# EAGLE design Raspberry_Zero_PLC_v1.0 (EAGLE 9.2.2)
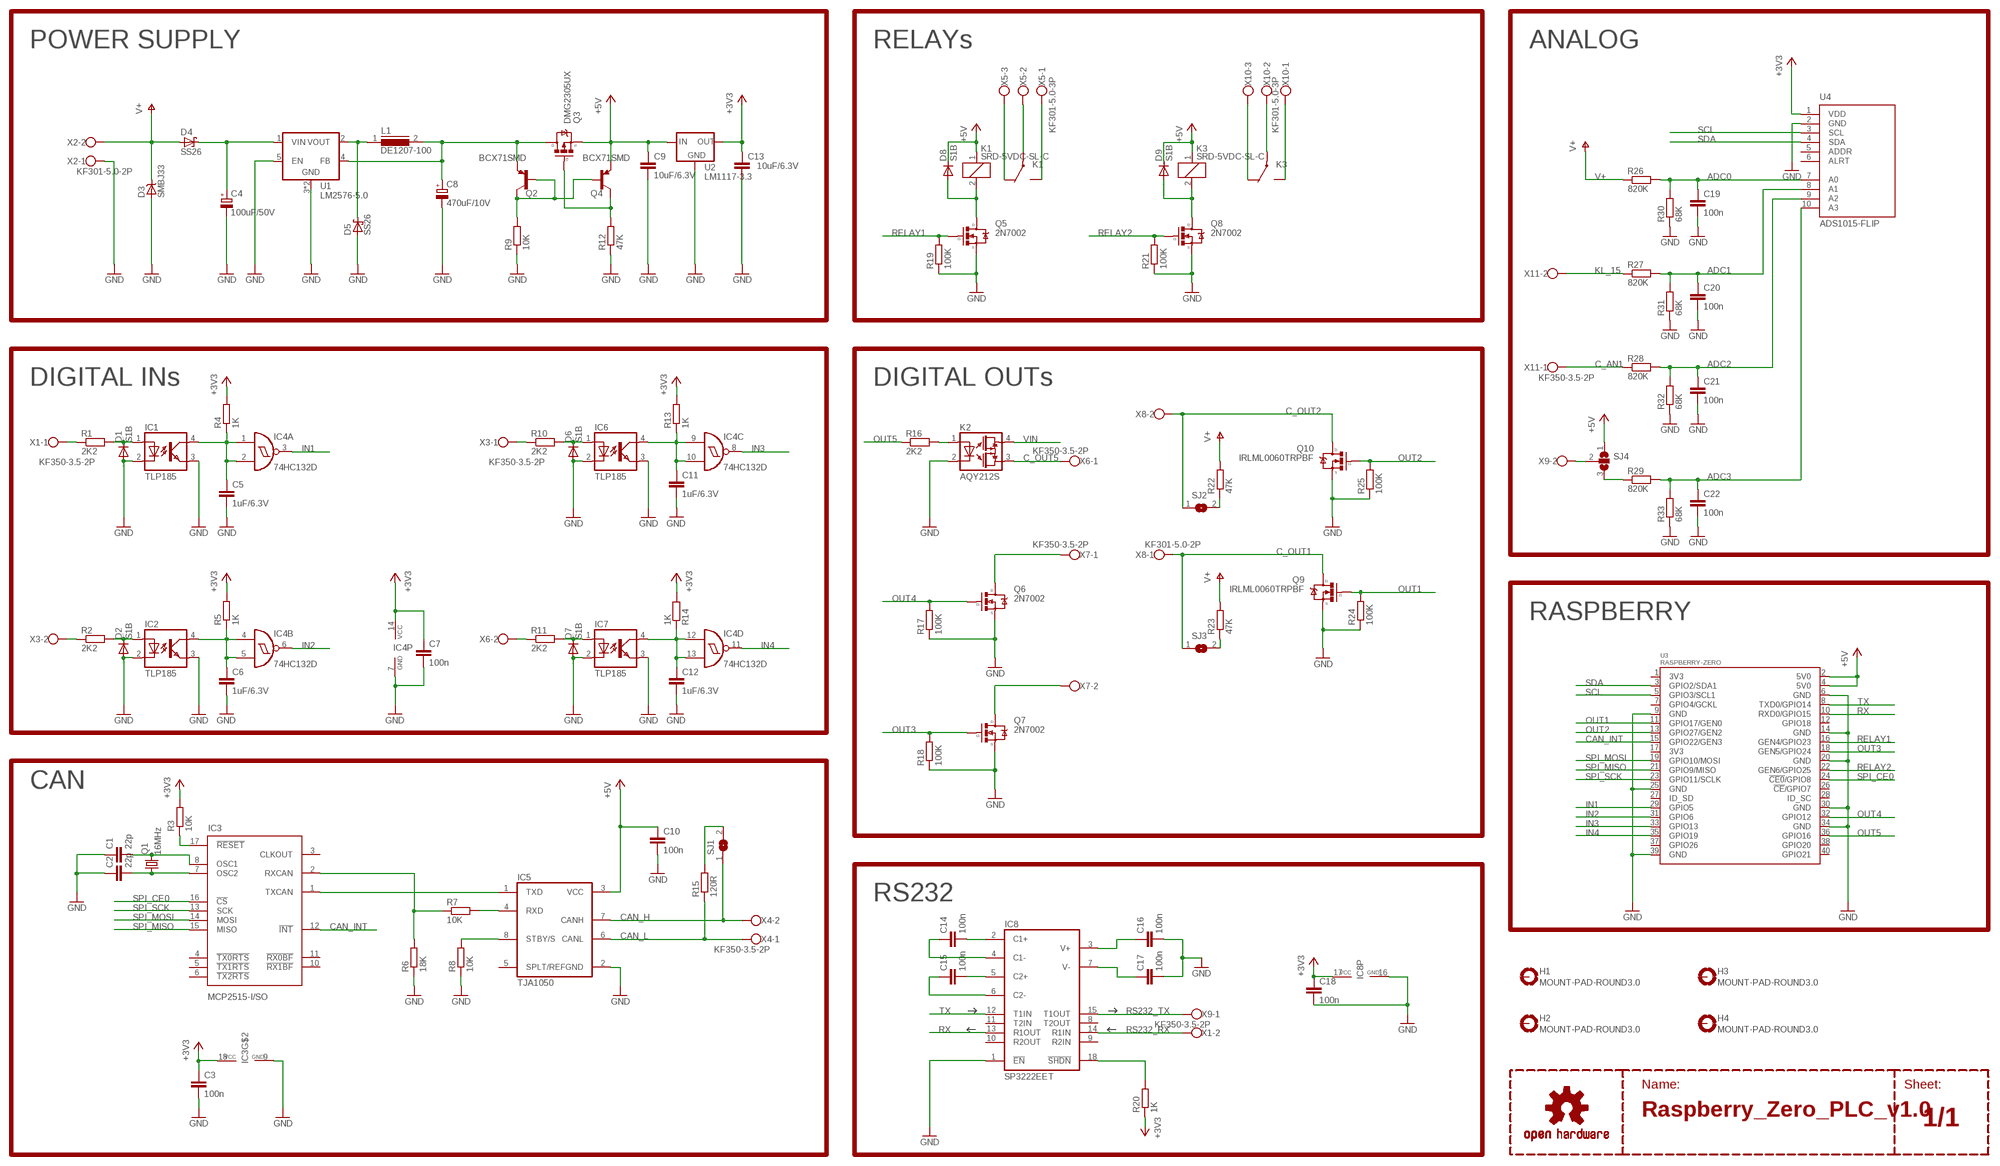
[diagram p0: schematic, sheet 1]

## Parts
C1  22p  C-EUC0805  [C0805]
C2  22p  C-EUC0805  [C0805]
C3  100n  C-EUC0805  [C0805]
C4  100uF/50V  CPOL-EUE  [PANASONIC_E]
C5  1uF/6.3V  C-EUC0805  [C0805]
C6  1uF/6.3V  C-EUC0805  [C0805]
C7  100n  C-EUC0805  [C0805]
C8  470uF/10V  CPOL-EUE  [PANASONIC_E]
C9  10uF/6.3V  C-EUC0805  [C0805]
C10  100n  C-EUC0805  [C0805]
C11  1uF/6.3V  C-EUC0805  [C0805]
C12  1uF/6.3V  C-EUC0805  [C0805]
C13  10uF/6.3V  C-EUC0805  [C0805]
C14  100n  C-EUC0805  [C0805]
C15  100n  C-EUC0805  [C0805]
C16  100n  C-EUC0805  [C0805]
C17  100n  C-EUC0805  [C0805]
C18  100n  C-EUC0805  [C0805]
C19  100n  C-EUC0805  [C0805]
C20  100n  C-EUC0805  [C0805]
C21  100n  C-EUC0805  [C0805]
C22  100n  C-EUC0805  [C0805]
D1  S1B  [DO214AC]
D2  S1B  [DO214AC]
D3  SMBJ33  [DO214AA]
D4  SS26  [DO214AA]
D5  SS26  [DO214AA]
D6  S1B  [DO214AC]
D7  S1B  [DO214AC]
D8  S1B  [DO214AC]
D9  S1B  [DO214AC]
H1  MOUNT-PAD-ROUND3.0  [3,0-PAD]
H2  MOUNT-PAD-ROUND3.0  [3,0-PAD]
H3  MOUNT-PAD-ROUND3.0  [3,0-PAD]
H4  MOUNT-PAD-ROUND3.0  [3,0-PAD]
IC1  TLP185  [SOP04]
IC2  TLP185  [SOP04]
IC3  MCP2515-I/SO  [SO-18L]
IC4  74HC132D  [SO14]
IC5  TJA1050  [SO08]
IC6  TLP185  [SOP04]
IC7  TLP185  [SOP04]
IC8  SP3222EET  [SO-18L]
K1  SRD-5VDC-SL-C  [SRD]
K2  AQY212S  CPC1008N  [SOP04]
K3  SRD-5VDC-SL-C  [SRD]
L1  DE1207-100  DR125  [DR125]
LOGO1  OSHW-LOGOM-COPPER  [OSHW-LOGO-M_COPPER]
Q1  16MHz  CRYSTALHC49U-V  [HC49U-V]
Q2  BCX71SMD  [SOT23]
Q3  DMG2305UX  [SOT23]
Q4  BCX71SMD  [SOT23]
Q5  2N7002  [SOT23]
Q6  2N7002  [SOT23]
Q7  2N7002  [SOT23]
Q8  2N7002  [SOT23]
Q9  IRLML0060TRPBF  [SOT23]
Q10  IRLML0060TRPBF  [SOT23]
R1  2K2  R-EU_R0805  [R0805]
R2  2K2  R-EU_R0805  [R0805]
R3  10K  R-EU_R0805  [R0805]
R4  1K  R-EU_R0805  [R0805]
R5  1K  R-EU_R0805  [R0805]
R6  18K  R-EU_R0805  [R0805]
R7  10K  R-EU_R0805  [R0805]
R8  10K  R-EU_R0805  [R0805]
R9  10K  R-EU_R0805  [R0805]
R10  2K2  R-EU_R0805  [R0805]
R11  2K2  R-EU_R0805  [R0805]
R12  47K  R-EU_R0805  [R0805]
R13  1K  R-EU_R0805  [R0805]
R14  1K  R-EU_R0805  [R0805]
R15  120R  R-EU_R1206  [R1206]
R16  2K2  R-EU_R0805  [R0805]
R17  100K  R-EU_R0805  [R0805]
R18  100K  R-EU_R0805  [R0805]
R19  100K  R-EU_R0805  [R0805]
R20  1K  R-EU_R0805  [R0805]
R21  100K  R-EU_R0805  [R0805]
R22  47K  R-EU_R0805  [R0805]
R23  47K  R-EU_R0805  [R0805]
R24  100K  R-EU_R0805  [R0805]
R25  100K  R-EU_R0805  [R0805]
R26  820K  R-EU_R0805  [R0805]
R27  820K  R-EU_R0805  [R0805]
R28  820K  R-EU_R0805  [R0805]
R29  820K  R-EU_R0805  [R0805]
R30  68K  R-EU_R0805  [R0805]
R31  68K  R-EU_R0805  [R0805]
R32  68K  R-EU_R0805  [R0805]
R33  68K  R-EU_R0805  [R0805]
SJ1  SJ  [SJ]
SJ2  SJ  [SJ]
SJ3  SJ  [SJ]
SJ4  SJ2W  [SJ_2]
U1  LM2576-5.0  [TO-263-5]
U2  LM1117-3.3  [SOT223]
U3  RASPBERRY-ZERO  [RASPBERRYPI_ZERO]
U4  ADS1015-FLIP  [ADS1115-_FLIP]
X1  KF350-3.5-2P  [KF350-3.50-2P]
X2  KF301-5.0-2P  [KF301-5.0-2P]
X3  KF350-3.5-2P  [KF350-3.50-2P]
X4  KF350-3.5-2P  [KF350-3.50-2P]
X5  KF301-5.0-3P  [KF301-5.0-3P]
X6  KF350-3.5-2P  [KF350-3.50-2P]
X7  KF350-3.5-2P  [KF350-3.50-2P]
X8  KF301-5.0-2P  [KF301-5.0-2P]
X9  KF350-3.5-2P  [KF350-3.50-2P]
X10  KF301-5.0-3P  [KF301-5.0-3P]
X11  KF350-3.5-2P  [KF350-3.50-2P]

## Nets
+3V3: C3.1 C7.1 C13.1 C18.1 IC3.18(VCC) IC4.14(P:VCC) IC8.17(VCC) R3.2 R4.2 R5.2 R13.2 R14.2 R20.1 U2.2(OUT) U2.4(OUT) U4.1(VDD)
+5V: C9.1 C10.1 D8.C D9.C IC5.3(VCC) K1.1 K3.1 Q3.2(S) Q4.2(E) SJ4.1 U2.3(IN) U3.2(5V0) U3.4(5V0)
ADC0: C19.1 R26.2 R30.2 U4.7(A0)
ADC1: C20.1 R27.2 R31.2 U4.8(A1)
ADC2: C21.1 R28.2 R32.2 U4.9(A2)
ADC3: C22.1 R29.2 R33.2 U4.10(A3)
C_AN1: R28.1 X11.1
C_AN2/5V: SJ4.2 X9.2
C_IN1: R1.1 X1.1
C_IN2: R2.1 X3.2
C_IN3: R10.1 X3.1
C_IN4: R11.1 X6.2
C_OUT1: Q9.3(D) SJ3.1 X8.1
C_OUT2: Q10.3(D) SJ2.1 X8.2
C_OUT3: Q7.3(D) X7.2
C_OUT4: Q6.3(D) X7.1
C_OUT5: K2.3(OUT0) X6.1
CAN_H: IC5.7(CANH) SJ1.1 X4.2
CAN_INT: IC3.12(!INT!) U3.15(GPIO22/GEN3)
CAN_L: IC5.6(CANL) R15.1 X4.1
GND: C1.1 C2.1 C3.2 C4.- C5.2 C6.2 C7.2 C8.- C9.2 C10.2 C11.2 C12.2 C13.2 C16.2 C17.2 C18.2 C19.2 C20.2 C21.2 C22.2 D1.A D2.A D3.A D5.A D6.A D7.A IC1.2(C) IC1.3(EMIT) IC2.2(C) IC2.3(EMIT) IC3.9(GND) IC4.7(P:GND) IC5.2(GND) IC6.2(C) IC6.3(EMIT) IC7.2(C) IC7.3(EMIT) IC8.1(!EN!) IC8.16(GND) K2.2(C) Q5.2(S) Q6.2(S) Q7.2(S) Q8.2(S) Q9.2(S) Q10.2(S) R6.1 R8.1 R9.1 R12.1 R17.1 R18.1 R19.1 R21.1 R24.1 R25.1 R30.1 R31.1 R32.1 R33.1 U1.3(GND) U1.5(EN) U1.6(GND) U2.1(GND) U3.6(GND) U3.9(GND) U3.14(GND) U3.20(GND) U3.25(GND) U3.30(GND) U3.34(GND) U3.39(GND) U4.2(GND) X2.1
IN1: IC4.3(A:O) U3.29(GPIO5)
IN2: IC4.6(B:O) U3.31(GPIO6)
IN3: IC4.8(C:O) U3.33(GPIO13)
IN4: IC4.11(D:O) U3.35(GPIO19)
KL_15: R27.1 X11.2
N$1: Q2.1(B) Q2.3(C) Q4.1(B) R9.2
N$2: Q3.1(G) Q4.3(C) R12.2
N$3: C2.2 IC3.7(OSC2) Q1.1
N$4: C8.+ L1.2 Q2.2(E) Q3.3(D) U1.4(FB)
N$5: C1.2 IC3.8(OSC1) Q1.2
N$6: IC3.1(TXCAN) IC5.1(TXD)
N$7: IC3.2(RXCAN) R6.2 R7.1
N$8: IC5.8(STBY/S) R8.2
N$9: D5.C L1.1 U1.2(VOUT)
N$10: IC5.4(RXD) R7.2
N$11: IC3.17(!RESET!) R3.1
N$13: D6.C IC6.1(A) R10.2
N$14: C16.1 IC8.3(V+)
N$15: C17.1 IC8.7(V-)
N$16: D9.A K3.2 Q8.3(D)
N$17: D8.A K1.2 Q5.3(D)
N$19: C15.2 IC8.5(C2+)
N$20: C15.1 IC8.6(C2-)
N$21: C14.1 IC8.4(C1-)
N$22: C14.2 IC8.2(C1+)
N$25: R29.1 SJ4.3
N$26: D1.C IC1.1(A) R1.2
N$27: D2.C IC2.1(A) R2.2
N$28: R22.1 SJ2.2
N$29: R23.1 SJ3.2
N$30: K2.1(A) R16.2
N$31: C5.1 IC1.4(COL) IC4.1(A:I0) IC4.2(A:I1) R4.1
N$32: C11.1 IC4.9(C:I0) IC4.10(C:I1) IC6.4(COL) R13.1
N$33: C6.1 IC2.4(COL) IC4.4(B:I0) IC4.5(B:I1) R5.1
N$36: C12.1 IC4.12(D:I0) IC4.13(D:I1) IC7.4(COL) R14.1
N$37: R15.2 SJ1.2
N$38: IC8.18(!SHDN!) R20.2
N$45: D7.C IC7.1(A) R11.2
OUT1: Q9.1(G) R24.2 U3.11(GPIO17/GEN0)
OUT2: Q10.1(G) R25.2 U3.13(GPIO27/GEN2)
OUT3: Q7.1(G) R18.2 U3.18(GEN5/GPIO24)
OUT4: Q6.1(G) R17.2 U3.32(GPIO12)
OUT5: R16.1 U3.36(GPIO16)
RELAY1: Q5.1(G) R19.2 U3.16(GEN4/GPIO23)
RELAY1_COM: K1.COM(P) X5.2
RELAY1_NC: K1.NC X5.3
RELAY1_NO: K1.NO X5.1
RELAY2: Q8.1(G) R21.2 U3.22(GEN6/GPIO25)
RELAY2_COM: K3.COM(P) X10.2
RELAY2_NC: K3.NC X10.3
RELAY2_NO: K3.NO X10.1
RS232_RX: IC8.14(R1IN) X1.2
RS232_TX: IC8.15(T1OUT) X9.1
RX: IC8.13(R1OUT) U3.10(RXD0/GPIO15)
SCL: U3.5(GPIO3/SCL1) U4.3(SCL)
SDA: U3.3(GPIO2/SDA1) U4.4(SDA)
SPI_CE0: IC3.16(!CS!) U3.24(!CE0!/GPIO8)
SPI_MISO: IC3.15(MISO) U3.21(GPIO9/MISO)
SPI_MOSI: IC3.14(MOSI) U3.19(GPIO10/MOSI)
SPI_SCK: IC3.13(SCK) U3.23(GPIO11/SCLK)
TX: IC8.12(T1IN) U3.8(TXD0/GPIO14)
V+: D3.C D4.A R22.2 R23.2 R26.1 X2.2
VIN: C4.+ D4.C K2.4(OUT1) U1.1(VIN)
Unconnected: H1.B3,0(MOUNT) H2.B3,0(MOUNT) H3.B3,0(MOUNT) H4.B3,0(MOUNT) IC3.3(CLKOUT) IC3.4(!TX0RTS!) IC3.5(!TX1RTS!) IC3.6(!TX2RTS!) IC3.10(!RX1BF!) IC3.11(!RX0BF!) IC5.5(SPLT/REF) IC8.8(T2OUT) IC8.9(R2IN) IC8.10(R2OUT) IC8.11(T2IN) U3.1(3V3) U3.7(GPIO4/GCKL) U3.12(GPIO18) U3.17(3V3) U3.26(!CE!/GPIO7) U3.27(ID_SD) U3.28(ID_SC) U3.37(GPIO26) U3.38(GPIO20) U3.40(GPIO21) U4.5(ADDR) U4.6(ALRT)

## Notes on the sheet
- POWER SUPPLY | RELAYs | ANALOG
- DIGITAL INs | DIGITAL OUTs
- RASPBERRY
- CAN
- RS232
- Name: | Sheet:

## Library data of the parts
C1-C3 C5-C7 C9-C22 = rcl:C-EU: CAPACITOR, European symbol
C4 C8 = rcl:CPOL-EU: POLARIZED CAPACITOR, European symbol
D1 D2 D6-D9 = my-diode:S1*: Rectifier Diode 1A; V: 70
D3 = my-diode:SMBJ*: TVS Diode
D4 D5 = my-diode:SS?*: Schottky Barrier Rectifier; A: 2; V: 60
H1-H4 = holes:MOUNT-PAD-ROUND: MOUNTING PAD, round
IC1 IC2 IC6 IC7 = my-opto:TLP185: Photocoupler
IC3 = my-ic:MCP2515-*/?: CAN Controller with SPI Interface
IC4 = 74xx-eu:74*132: Quad 2-input NAND schmitt trigger
IC5 = my-ic:TJA10*0: High speed CAN transceiver
IC8 = my-ic:SP3222: RS232 TRANSCEIVER with EN 3.3V - 5.5V; ESD: ESD protection; TEMP_RANGE: -40 to 85 °C
K1 K3 = my-relay:SRD-*VDC-SL-C: General purpose relay
K2 = my-relay:CPC1008N: OptoMOS® relay
L1 = inductors:DR125: High Power Density, High Efficiency, Shielded Inductors Source: coiltronics_dr_series.pdf
LOGO1 = SparkFun-Aesthetics:OSHW-LOGO: Open-Source Hardware (OSHW) Logo This logo indicates the piece of hardware it is found on incorporates a OSHW license and/or adheres to the definition of open source hardware found here: http://freedomdefined.org/OSHW
Q1 = crystal:CRYSTAL: CRYSTAL; OC_FARNELL: 1666969; OC_NEWARK: unknown
Q2 Q4 = transistor-pnp:BCX71SMD: PNP Transistor
Q3 = my-mosfet:DMG2305UX: P-channel, enhancement-mode MOSFET
Q5-Q8 = my-mosfet:2N7002: N-Channel Trench MOSFET
Q9 Q10 = my-mosfet:IRLML0060TRPBF: N-CHANNEL Power MOSFET max 60V, 2.7A
R1-R33 = rcl:R-EU_: RESISTOR, European symbol
SJ1-SJ3 = jumper:SJ: SMD solder JUMPER
SJ4 = jumper:SJ2W: SMD solder JUMPER
U1 = my-power:LM2576-*: 3A Step-Down Regulator
U2 = my-power:LM1117-*: LDO regulator
U3 = my-modules:RASPBERRY-?
U4 = my-modules:ADS1*15: 4 Channel 12/16-Bit ADC Converter
X1 X3 X4 X6 X7 X9 X11 = my-connectors:KF350-3.5-2P: Screw terminal 3.5mm pitch
X2 X8 = my-connectors:KF301-5.0-2P: Screw terminal
X5 X10 = my-connectors:KF301-5.0-3P: Screw terminal

## Board
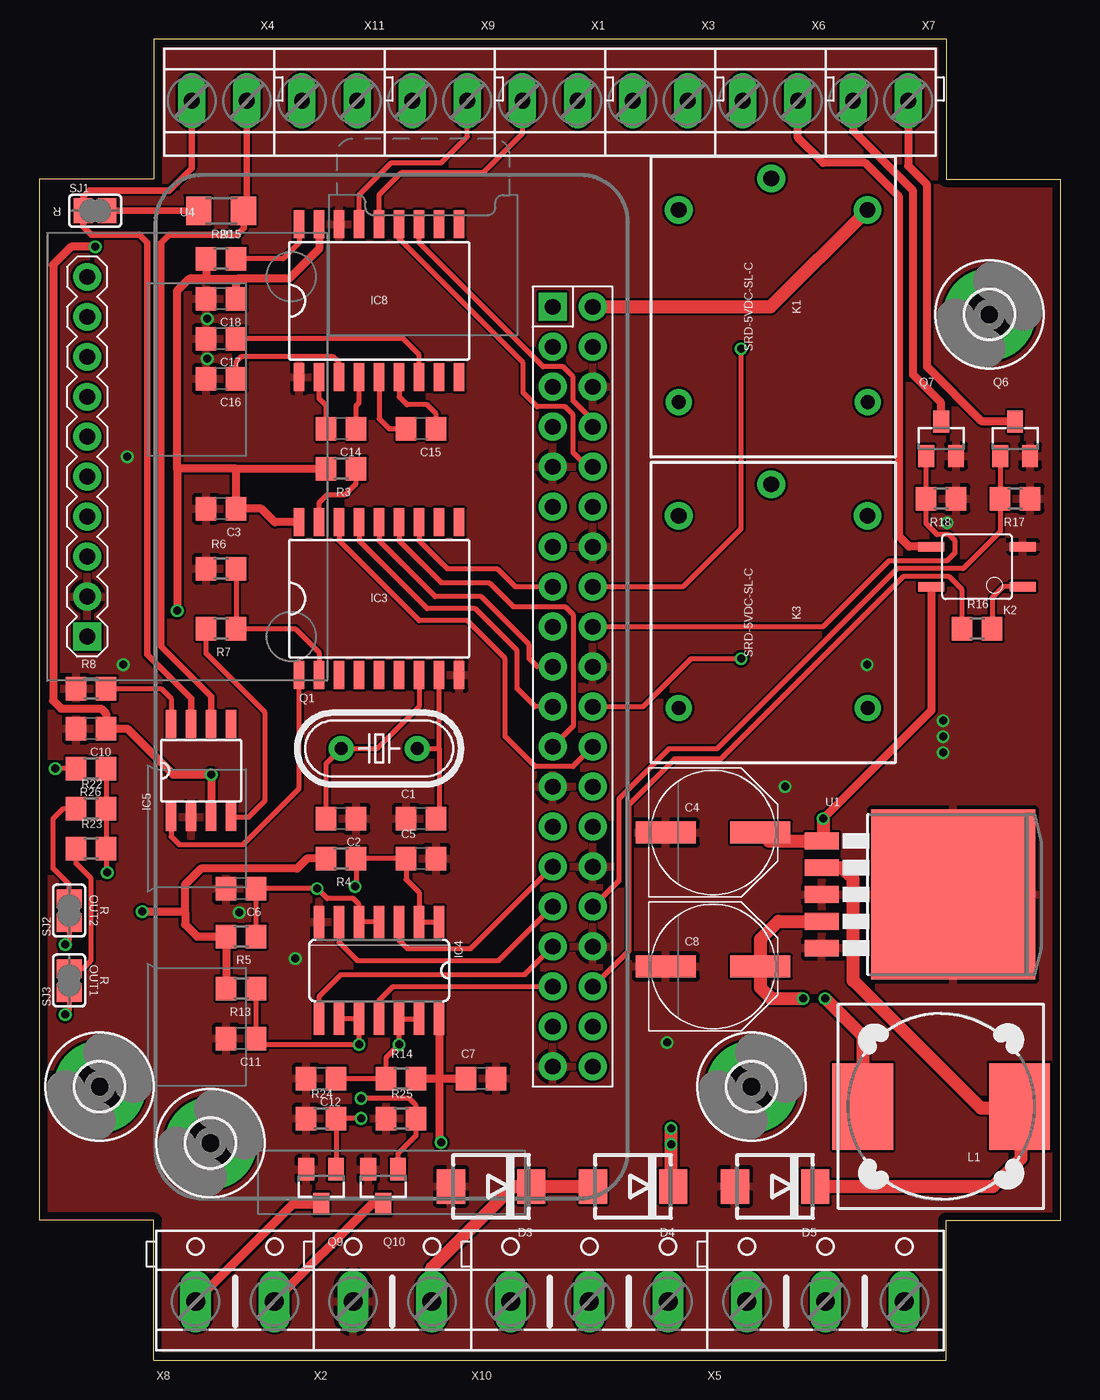
[diagram p1: board, top side]
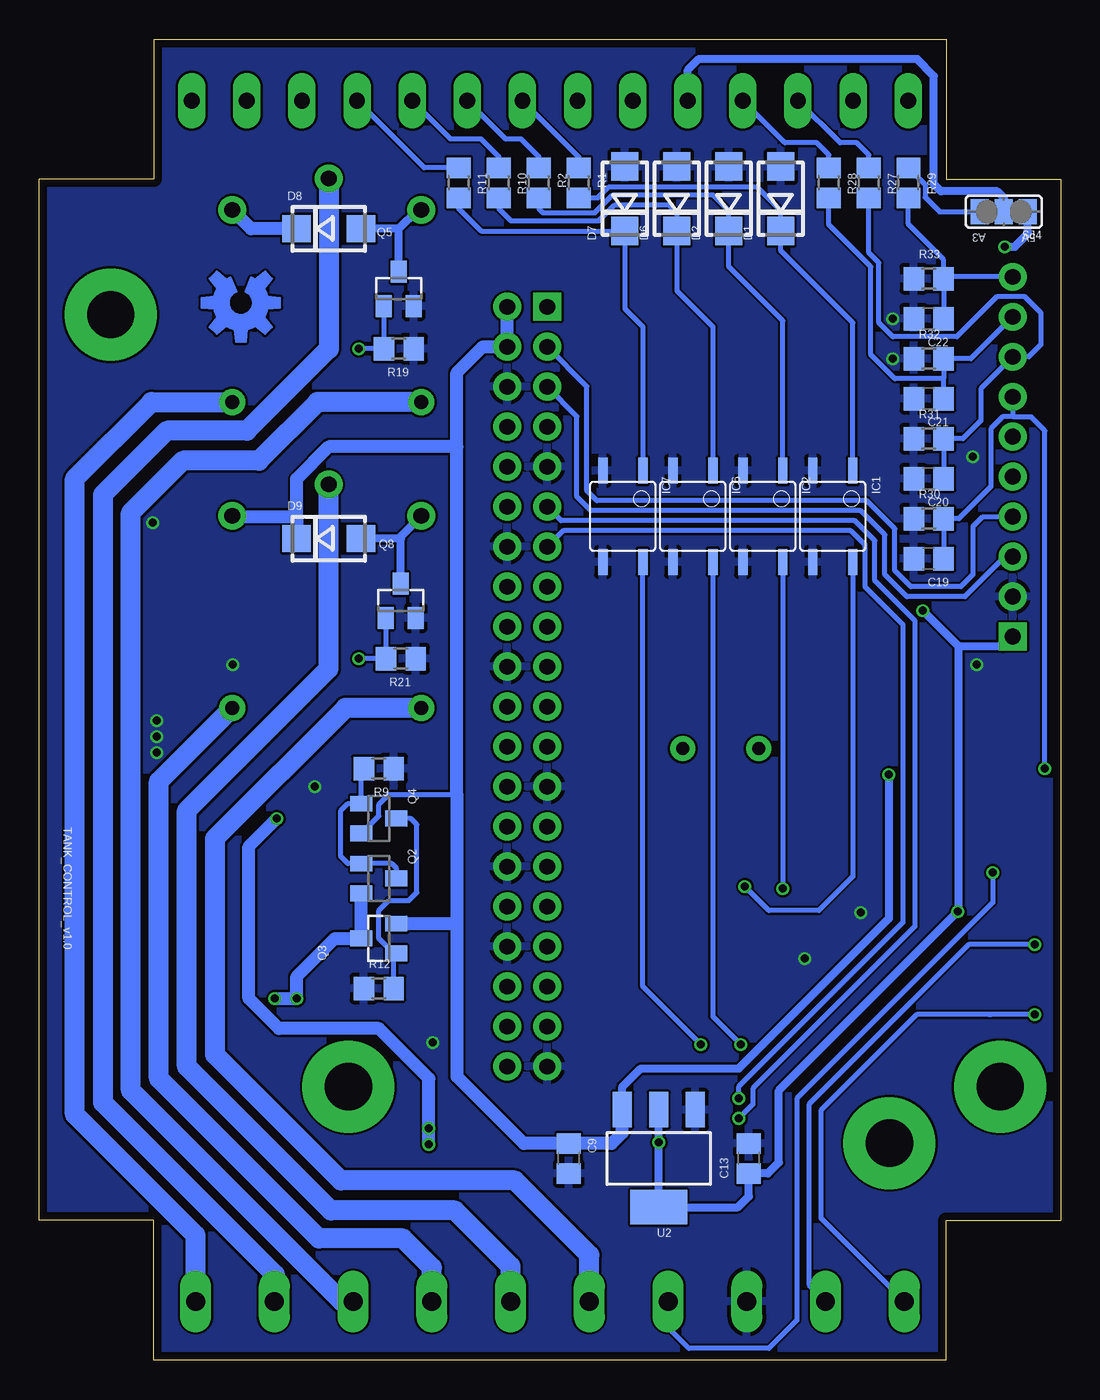
[diagram p2: board, bottom side, seen from below]

Size 64.85 x 83.91 mm. Coordinates in mm from the lower left corner, seen from the top.
Outline: 7.27,0 57.58,0 57.58,8.88 64.85,8.88 64.85,75.03 57.58,75.03 57.58,83.91 7.27,83.91 7.27,75.03 0,75.03 0,8.88 7.27,8.88 7.27,0
Copper layers (1*16): Top 0.035mm / dielectric 1.6mm / Bottom 0.035mm
Design rules "Elecrow_2-layer_PCB_eagle_rule *": minimum track width 6mil, minimum drill 12mil, track to track 6mil, track to pad 6mil, pad to pad 6mil, via to via 8mil, smd to smd 0mil, copper to edge 20mil, drill to drill 10mil, minimum pad ring 15mil, minimum via ring 6mil, stop-mask expansion 0mil, vias tented up to drill 100mil, thermal gap 10mil

### Footprints (pad centres in the part's own frame; a part is rotated, then mirrored left to right if it is on the bottom)
C0805 = smd 1.3 x 1.5: 1 -0.95,0; 2 0.95,0
PANASONIC_E = smd 3.8 x 1.4: + 3,0; - -3,0
DO214AC = smd 1.8 x 1.7: A 2.05,0; C -2.05,0
DO214AA = smd 1.8 x 2.2: A 2.55,0; C -2.55,0
3,0-PAD = drill 3 pad 5.842: B3,0 0,0
SOP04 = smd 1.65 x 0.6: 1 -2.9,1.27; 2 -2.9,-1.27; 3 2.9,-1.27; 4 2.9,1.27
SO-18L = smd 0.66 x 1.778: 1 -5.08,-4.851; 2 -3.81,-4.851; 3 -2.54,-4.851; 4 -1.27,-4.851; 5 0,-4.851; 6 1.27,-4.851; 7 2.54,-4.851; 8 3.81,-4.851; 9 5.08,-4.851; 10 5.08,4.851; 11 3.81,4.851; 12 2.54,4.851; 13 1.27,4.851; 14 0,4.851; 15 -1.27,4.851; 16 -2.54,4.851; 17 -3.81,4.851; 18 -5.08,4.851
SO14 = smd 0.66 x 2.032: 1 -3.81,-3.073; 2 -2.54,-3.073; 3 -1.27,-3.073; 4 0,-3.073; 5 1.27,-3.073; 6 2.54,-3.073; 7 3.81,-3.073; 8 3.81,3.073; 9 2.54,3.073; 10 1.27,3.073; 11 0,3.073; 12 -1.27,3.073; 13 -2.54,3.073; 14 -3.81,3.073
SO08 = smd 0.66 x 1.778: 1 -1.905,-2.946; 2 -0.635,-2.946; 3 0.635,-2.946; 4 1.905,-2.946; 5 1.905,2.946; 6 0.635,2.946; 7 -0.635,2.946; 8 -1.905,2.946
SRD = drill 1: 1 -6.15,6; 2 -6.15,-6; COM -8.15,-0.12 | drill 0.9: NC 6.05,6; NO 6.05,-6
DR125 = smd 3.85 x 5.5: 1 -4.975,0; 2 4.975,0
HC49U-V = drill 0.813: 1 -2.413,0; 2 2.413,0
SOT23 = smd 1 x 1.4: 1 -0.95,-1.1; 2 0.95,-1.1; 3 0,1.1
R0805 = smd 1.3 x 1.5: 1 -0.95,0; 2 0.95,0
R1206 = smd 1.6 x 1.803: 1 -1.422,0; 2 1.422,0
SJ = smd 1.168 x 1.6: 1 -0.762,0; 2 0.762,0
SJ_2 = smd 1.168 x 1.6: 1 -1.524,0; 2 0,0; 3 1.524,0
TO-263-5 = smd 1.067 x 2.159: 1 -3.404,-5.791; 2 -1.702,-5.791; 3 0,-5.791; 4 1.702,-5.791; 5 3.404,-5.791 | smd 10.8 x 10.41: 6 0,2.54
SOT223 = smd 1.219 x 2.235: 1 -2.311,-3.099; 2 0,-3.099; 3 2.311,-3.099 | smd 3.6 x 2.2: 4 0,3.099
RASPBERRYPI_ZERO = drill 1 pad 1.778 square: 1 -24.13,10.23 | drill 1 pad 1.778: 2 -24.13,12.77; 3 -21.59,10.23; 4 -21.59,12.77; 5 -19.05,10.23; 6 -19.05,12.77; 7 -16.51,10.23; 8 -16.51,12.77; 9 -13.97,10.23; 10 -13.97,12.77; 11 -11.43,10.23; 12 -11.43,12.77; 13 -8.89,10.23; 14 -8.89,12.77; 15 -6.35,10.23; 16 -6.35,12.77; 17 -3.81,10.23; 18 -3.81,12.77; 19 -1.27,10.23; 20 -1.27,12.77; 21 1.27,10.23; 22 1.27,12.77; 23 3.81,10.23; 24 3.81,12.77; 25 6.35,10.23; 26 6.35,12.77; 27 8.89,10.23; 28 8.89,12.77; 29 11.43,10.23; 30 11.43,12.77; 31 13.97,10.23; 32 13.97,12.77; 33 16.51,10.23; 34 16.51,12.77; 35 19.05,10.23; 36 19.05,12.77; 37 21.59,10.23; 38 21.59,12.77; 39 24.13,10.23; 40 24.13,12.77
ADS1115-_FLIP = drill 1 square: 1 -6.35,-11.43 | drill 1: 2 -6.35,-8.89; 3 -6.35,-6.35; 4 -6.35,-3.81; 5 -6.35,-1.27; 6 -6.35,1.27; 7 -6.35,3.81; 8 -6.35,6.35; 9 -6.35,8.89; 10 -6.35,11.43
KF350-3.50-2P = drill 1 long: 1 -1.75,0; 2 1.75,0
KF301-5.0-2P = drill 1.2 long: 1 -2.5,0; 2 2.5,0
KF301-5.0-3P = drill 1.2 long: 1 -5,0; 2 0,0; 3 5,0

### Placement (x,y rotation side)
C1  24.25,34.41 0 top
C2  19.16,34.41 180 top
C3  11.55,54.09 180 top
C4  42.79,33.52 0 top
C5  24.25,31.86 0 top
C6  12.82,29.96 180 top
C7  28.05,17.89 0 top
C8  42.79,25.01 0 top
C9  31.23,12.82 270 bottom
C10  3.29,40.12 180 top
C11  12.82,20.43 180 top
C12  17.89,17.89 180 top
C13  19.8,12.82 90 bottom
C14  19.16,59.17 180 top
C15  24.25,59.17 180 top
C16  11.55,62.34 180 top
C17  11.55,64.89 180 top
C18  11.55,67.42 180 top
C19  8.37,50.92 180 bottom
C20  8.37,56 180 bottom
C21  8.37,61.08 180 bottom
C22  8.37,66.16 180 bottom
D1  17.77,73.78 90 bottom
D2  21.07,73.78 90 bottom
D3  28.69,11.04 180 top
D4  37.71,11.04 180 top
D5  46.72,11.04 180 top
D6  24.37,73.78 90 bottom
D7  27.67,73.78 90 bottom
D8  46.47,71.87 0 bottom
D9  46.47,52.19 0 bottom
H1  3.83,17.38 0 top
H2  45.23,17.38 0 top
H3  60.33,66.42 0 top
H4  10.87,13.78 0 top
IC1  14.47,53.61 270 bottom
IC2  18.91,53.61 270 bottom
IC3  21.58,48.38 0 top
IC4  21.58,24.75 180 top
IC5  10.27,37.45 0 top
IC6  23.36,53.61 270 bottom
IC7  27.8,53.61 270 bottom
IC8  21.58,67.3 0 top
K1  46.6,66.92 270 top
K2  59.55,50.41 180 top
K3  46.6,47.49 270 top
L1  57.27,16.12 180 top
LOGO1  52.06,67.17 180 bottom
Q1  21.58,38.85 0 top
Q2  43.3,30.6 270 bottom
Q3  43.3,26.79 90 bottom
Q4  43.3,34.41 270 bottom
Q5  42.03,68.06 0 bottom
Q6  61.96,58.54 0 top
Q7  57.27,58.54 0 top
Q8  41.9,48.25 0 bottom
Q9  17.89,11.04 180 top
Q10  21.83,11.04 180 top
R1  30.6,74.79 270 bottom
R2  33.14,74.79 270 bottom
R3  19.16,56.63 180 top
R4  19.16,31.86 180 top
R5  12.82,26.91 180 top
R6  11.55,50.28 0 top
R7  11.55,46.47 180 top
R8  3.29,42.66 0 top
R9  43.3,37.58 180 bottom
R10  35.68,74.79 270 bottom
R11  38.22,74.79 270 bottom
R12  43.3,23.61 0 bottom
R13  12.82,23.61 180 top
R14  22.97,17.89 0 top
R15  11.55,73.01 180 top
R16  59.55,46.47 0 top
R17  61.96,54.73 180 top
R18  57.27,54.73 180 top
R19  42.03,64.25 180 bottom
R20  11.55,69.97 0 top
R21  41.9,44.57 180 bottom
R22  3.29,35.04 0 top
R23  3.29,32.5 0 top
R24  17.89,15.36 0 top
R25  22.97,15.36 0 top
R26  3.29,37.58 180 top
R27  12.18,74.79 270 bottom
R28  14.72,74.79 270 bottom
R29  9.67,74.79 270 bottom
R30  8.37,53.46 0 bottom
R31  8.37,58.54 0 bottom
R32  8.37,63.62 0 bottom
R33  8.37,68.7 0 bottom
SJ1  3.54,73.01 0 top
SJ2  1.89,28.56 90 top
SJ3  1.89,24.12 90 top
SJ4  3.61,72.96 180 bottom
U1  55.49,29.58 270 top
U2  25.52,12.82 180 bottom
U3  22.37,42.78 270 top
U4  9.39,57.39 0 top
X1  32.43,80.01 180 top
X2  22.43,3.73 0 top
X3  39.43,80.01 180 top
X4  11.43,80.01 180 top
X5  49.93,3.73 0 top
X6  46.43,80.01 180 top
X7  53.43,80.01 180 top
X8  12.43,3.73 0 top
X9  25.43,80.01 180 top
X10  34.93,3.73 0 top
X11  18.43,80.01 180 top

### Tracks (layer width: path | path; a pad name or v marks a point on that pad's centre or on a via)
+3V3  (via drill 0.5)
  Top 0.508: C18.1 12.5,68.63 12.56,68.7 | IC8.17 17.77,70.6 15.86,68.7 12.56,68.7 | R13.2 R5.2 10.02,26.91 9.26,27.67 9.26,28.44 | IC4.14 25.39,17.89 | 25.39,17.89 25.39,13.96 v25.52,13.83 | R14.2 25.39,17.89 | 25.39,17.89 C7.1 | 10.66,68.7 12.56,68.7 | 10.66,68.7 9.51,68.7 8.75,67.93 8.75,56.63 | 10.66,68.7 10.59,68.76 R20.1 | 8.75,56.63 v8.75,47.61 | IC3.18 14.95,53.23 14.09,54.09 C3.1 12.5,56.63 | 12.5,56.63 R3.2 | 12.5,56.63 8.75,56.63 | R4.2 17.01,31.86 16.37,31.23 10.27,31.23 9.26,30.21 9.26,28.44 | v6.53,28.5 9.2,28.5 9.26,28.44
  Bottom 0.508: U2.2 v25.52,13.83 U2.4 20.49,9.72 19.8,10.4 C13.1 18.59,11.86 17.89,12.56 17.89,17.13 v6.53,28.5 6.47,28.56 6.47,45.33 | v8.75,47.61 6.47,45.33 | 6.47,45.33 3.67,45.33 U4.1
+5V  (via drill 0.5)
  Top 0.508: IC5.3 v10.91,37.2 8.5,37.2 5.58,40.12 C10.1 4.24,41.08 3.92,41.39 1.39,41.39 0.88,41.9 0.88,69.58 2.02,70.73 v3.54,70.73
  Top 0.813: U3.2 46.44,66.91 K1.1
  Bottom 0.305: Q4.2 43.3,34.55 43.3,35.29 42.66,35.93 38.34,35.93
  Bottom 0.508: v10.91,37.2 10.91,28.05 20.43,18.53 26.66,18.53 27.83,17.36 U2.3 | v3.54,70.73 2.91,70.73 2.08,71.55 SJ4.1
  Bottom 0.813: U2.3 27.83,14.44 28.5,13.77 C9.1 34.09,13.77 38.34,18.02 38.34,27.67 | 38.34,27.67 38.34,35.93 38.34,58.03 | 38.34,58.03 38.34,62.73 36.69,64.38 U3.4 U3.2 | 38.34,27.67 38.4,27.73 Q3.2 | 38.34,58.03 46.47,58.03 48.52,55.98 48.52,53.58 | 48.52,53.58 D9.C | K3.1 52.54,53.58 48.52,53.58 | D8.C 51.4,71.87 K1.1
ADC0  (via drill 0.5)
  Top 0.305: R26.2 v1,37.58
  Bottom 0.305: R30.2 C19.1 | R30.2 7.42,53.52 | v1,37.58 1,59.04 1.89,59.93 3.04,59.93 | R30.2 6.47,53.46 4.43,55.49 4.43,59.17 3.67,59.93 3.04,59.93 | U4.7 3.04,59.93
ADC1
  Bottom 0.305: R27.2 12.18,70.35 11.55,69.71 11.55,65.9 10.66,65.01 6.59,65.01 4.05,67.55 2.27,67.55 1.26,66.54 1.26,64.5 2.02,63.74 U4.8 5.07,61.71 5.07,59.68 6.21,58.54 R31.2 C20.1
ADC2
  Bottom 0.305: R28.2 14.72,72.12 12.05,69.46 12.05,63.87 10.53,62.34 7.42,62.34 | C21.1 7.42,62.34 | 7.42,62.34 R32.2 5.7,63.62 U4.9
ADC3
  Bottom 0.305: R29.2 9.66,72.15 7.42,69.9 R33.2 | R33.2 C22.1 | U4.10 7.29,68.82 R33.2
C_AN1
  Bottom 0.305: R28.1 14.72,76.57 15.48,77.33 17.5,77.33 X11.1
C_AN2/5V
  Bottom 0.508: SJ4.2 3.61,73.84 4.03,74.26 7.61,74.26 8.04,74.69 8.04,81.57 9.13,82.67 22.97,82.67 23.68,81.97 X9.2
C_IN1
  Bottom 0.305: X1.1 30.6,76.42 R1.1
C_IN2
  Bottom 0.305: X3.2 35.26,77.59 34.28,77.59 33.14,76.44 R2.1
C_IN3
  Bottom 0.305: X3.1 38.76,77.59 36.82,77.59 35.68,76.44 R10.1
C_IN4
  Bottom 0.305: R11.1 40.41,75.74 X6.2
C_OUT1  (via drill 0.5)
  Top 0.305: SJ3.1 1.89,22.21 v1.64,21.96
  Top 0.61: Q9.3 16.14,9.94 X8.1
  Bottom 0.305: v1.64,21.96 4.43,21.96 | 4.43,21.96 4.56,21.96 | 4.43,21.96 9.13,21.96 15.23,15.86 15.23,9.03 X8.1
C_OUT2  (via drill 0.5)
  Top 0.305: SJ2.1 1.89,26.66 v1.64,26.4
  Top 0.61: Q10.3 21.14,9.94 X8.2
  Bottom 0.305: v1.64,26.4 5.83,26.4 15.99,16.24 15.99,4.79 X8.2
C_OUT3
  Top 0.508: X7.2 51.68,78.09 55.49,74.28 55.49,62.6 57.27,60.82 Q7.3
C_OUT4
  Top 0.508: X7.1 55.18,75.87 56.38,74.66 56.38,63.11 59.85,59.64 Q6.3
C_OUT5
  Top 0.508: K2.3 55.23,51.68 54.6,52.31 54.6,73.9 52.44,76.06 49.77,76.06 48.18,77.66 X6.1
CAN_H
  Top 0.406: IC5.7 9.64,42.03 6.85,44.82 6.85,70.98 6.34,71.49 3.29,71.49 2.78,72 SJ1.1 2.78,73.9 3.16,74.28 8.24,74.28 9.68,75.72 X4.2
CAN_INT
  Top 0.305: IC3.12 24.12,52.06 25.9,50.28 29.07,50.28 30.22,49.13 U3.15
CAN_L
  Top 0.406: 12.94,72.99 R15.1 | R15.1 12.97,71.89 12.56,71.49 8.24,71.49 7.74,70.98 7.74,45.33 10.91,42.15 IC5.6 | X4.1 13.18,73.25 12.97,73.04 R15.1
GND  (via drill 0.5)
  other vias: 16.24,25.52 10.66,63.62 10.66,66.16 5.58,57.39 12.69,28.44 47.36,36.44 39.87,20.18 57.39,40.63 57.39,39.61 57.39,38.6 52.57,44.18 57.65,53.2 5.32,44.18
  pour Top: -0.14,9 7.23,9 7.23,0.12 57.77,0.12 57.77,8.75 64.89,8.75 64.89,75.05 57.52,75.05 57.52,83.94 7.23,83.94 7.23,75.05 -0.14,75.05
  pour Bottom: 65.14,9 57.77,9 57.77,0.12 7.23,0.12 7.23,8.75 0.12,8.75 0.12,75.05 7.48,75.05 7.48,83.94 57.77,83.94 57.77,75.05 65.14,75.05
IN1
  Top 0.305: IC4.3 22.85,26.66 23.36,26.15 27.4,26.15 U3.29
IN2
  Top 0.305: IC4.6 19.04,26.53 20.18,25.39 29.18,25.39 U3.31
IN3
  Top 0.305: IC4.8 17.77,23.1 19.16,24.5 30.83,24.5 U3.33
IN4
  Top 0.305: IC4.11 21.58,22.85 22.46,23.73 U3.35
KL_15
  Bottom 0.305: R27.1 12.18,76.57 12.94,77.33 14,77.33 X11.2
N$1
  Bottom 0.305: Q2.3 42.2,31.27 42.47,31.54 Q2.1 45.26,31.54 45.71,31.99 45.71,34.91 45.27,35.36 Q4.1 44.4,37.43 R9.2
N$2
  Bottom 0.305: R12.2 42.35,25.68 Q3.1 42.35,25.84 43.3,26.79 43.3,28.56 42.66,29.2 41.39,29.2 40.88,29.71 40.88,34.02 41.26,34.41 Q4.3
N$3
  Top 0.305: IC3.7 24.12,41.52 21.45,38.85 Q1.1 18.21,37.9 C2.2
N$4  (via drill 0.5)
  Top 0.813: U1.4 46.93,27.88 45.79,26.74 C8.+ 45.79,23.66 46.47,22.97 v48.5,22.97 | L1.2 52.29,20.58 v49.9,22.97
  Bottom 0.813: Q2.2 Q3.3 46.09,26.79 48.5,24.37 v48.5,22.97 v49.9,22.97
N$5
  Top 0.305: Q1.2 24.88,38.85 25.07,38.85 25.39,38.85 | C1.2 25.39,34.6 25.39,38.85 | 25.39,38.85 IC3.8
N$6
  Top 0.305: IC5.1 8.37,33.26 8.88,32.75 12.94,32.75 16.5,36.31 IC3.1
N$7
  Top 0.305: R6.2 R7.1 16.24,46.47 17.77,44.95 IC3.2
N$8
  Top 0.305: R8.2 7.74,42.66 8.37,42.03 IC5.8
N$9
  Top 0.813: 49.7,31.23 U1.2 50.99,31.28 51.68,30.6 51.68,24.12 59.78,16.01 62.34,16.01 | D5.C 60.57,11.04 62.34,12.82 62.34,16.01 | 62.34,16.01 L1.1
N$10
  Top 0.305: IC5.4 13.3,34.51 14.34,35.55 14.34,41.14 10.59,44.88 R7.2
N$11
  Top 0.305: IC3.17 17.77,54.47 18.28,54.98 19.42,54.98 20.11,55.68 R3.1
N$13
  Bottom 0.305: R10.2 35.68,73.14 34.91,72.38 29.32,72.38 28.31,73.39 24.88,73.39 24.37,72.89 D6.C 24.37,67.93 22.09,65.65 IC6.1
N$14
  Top 0.305: C16.1 12.5,63.42 12.82,63.74 18.66,63.74 19.04,63.36 IC8.3
N$15
  Top 0.305: IC8.7 24.12,63.87 23.1,64.89 C17.1
N$16
  Bottom 0.508: Q8.3 41.9,52.19 | 41.9,52.19 D9.A | 41.9,52.19 41.9,52.34 K3.2
N$17
  Bottom 0.508: Q5.3 42.03,71.87 | 42.03,71.87 D8.A | 42.03,71.87 40.83,73.07 K1.2
N$19
  Top 0.305: C15.2 22.21,59.17 21.58,59.8 IC8.5
N$20
  Top 0.305: IC8.6 22.85,61.2 23.36,60.69 24.63,60.69 25.2,60.12 C15.1
N$21
  Top 0.305: IC8.4 20.31,60.82 20.11,60.63 C14.1
N$22
  Top 0.305: IC8.2 17.77,61.08 18.21,60.63 C14.2
N$25
  Bottom 0.305: R29.1 8.6,74.67 8.6,73.88 7.68,72.96 SJ4.3
N$26
  Bottom 0.305: R1.2 29.39,73.84 28.69,74.54 19.29,74.54 17.77,73.01 D1.C 17.77,70.47 13.2,65.9 IC1.1
N$27
  Bottom 0.305: R2.2 33.14,73.14 32.88,72.89 29.58,72.89 28.44,74.03 22.09,74.03 21.07,73.01 D2.C 21.07,69.46 17.64,66.03 IC2.1
N$28
  Top 0.305: SJ2.2 1.89,30.21 0.88,31.23 0.88,34.41 1.51,35.04 R22.1
N$29
  Top 0.305: SJ3.2 2.78,24.88 3.29,25.39 3.29,30.6 2.34,31.54 R23.1
N$30
  Top 0.305: R16.2 60.5,48.44 61.2,49.14 K2.1
N$31  (via drill 0.5)
  Top 0.305: IC4.1 IC4.2 24.12,29.71 23.29,30.53 C5.1 R4.1 20.11,30.15 v20.05,30.09
  Bottom 0.305: IC1.4 13.2,30.72 15.36,28.56 18.53,28.56 v20.05,30.09
N$32  (via drill 0.5)
  Top 0.305: 20.18,21.68 IC4.9 | 20.18,21.68 IC4.10 | R13.1 C11.1 14.15,20.05 v20.31,20.05 20.31,21.55 20.18,21.68
  Bottom 0.305: v20.31,20.05 22.09,21.83 IC6.4
N$33  (via drill 0.5)
  Top 0.305: R5.1 C6.1 v17.64,29.96 18.28,29.32 19.93,29.32 20.31,28.94 IC4.5 IC4.4
  Bottom 0.305: IC2.4 v17.64,29.96
N$36  (via drill 0.5)
  Top 0.305: IC4.13 IC4.12 v22.85,20.05 22.02,19.23 R14.1 C12.1
  Bottom 0.305: IC7.4 26.53,23.74 v22.85,20.05
N$37
  Top 0.406: SJ1.2 R15.2
N$38
  Top 0.305: IC8.18 16.5,70.98 15.48,69.97 R20.2
N$45
  Bottom 0.305: R11.2 38.22,73.14 36.8,71.73 D7.C 27.67,66.79 26.53,65.65 IC7.1
OUT1  (via drill 0.5)
  Top 0.305: Q9.1 R24.2 v20.43,15.36
  Bottom 0.305: U3.11 31.71,53.33 13.07,53.33 11.8,52.06 11.8,49.52 9.26,46.98 9.26,27.55 19.55,17.26 19.55,16.24 v20.43,15.36
OUT2  (via drill 0.5)
  Top 0.305: Q10.1 22.78,13.13 23.93,14.27 R25.2 23.93,16.18 23.48,16.62 v20.43,16.62
  Bottom 0.305: U3.13 31.58,52.69 13.32,52.69 12.43,51.8 12.43,49.14 10.02,46.72 10.02,27.8 20.43,17.39 v20.43,16.62
OUT3
  Top 0.305: Q7.1 R18.2 56.32,53.14 57.01,52.44 57.77,52.44 58.15,52.06 58.15,51.3 57.65,50.79 53.96,50.79 49.77,46.59 U3.18
OUT4
  Top 0.305: Q6.1 R17.2 61.01,52.63 58.66,50.28 54.47,50.28 43.04,38.85 39.99,38.85 36.82,35.68 36.82,30.47 35.16,28.81 U3.32
OUT5
  Top 0.305: U3.36 35.16,23.73 37.45,26.02 37.45,35.29 40.37,38.22 43.3,38.22 54.85,49.77 57.77,49.77 58.6,48.94 R16.1
RELAY1  (via drill 0.5)
  Top 0.305: U3.16 40.88,49.13 44.57,52.82 v44.57,64.25
  Bottom 0.305: Q5.1 R19.2 v44.57,64.25
RELAY1_COM
  Bottom 1.27: X5.2 49.9,3.75 49.9,5.45 60.82,16.37 60.82,54.98 56.76,59.04 51.68,59.04 46.47,64.25 K1.COM
RELAY1_NC
  Bottom 1.27: X5.3 54.93,7.93 62.6,15.61 62.6,56 57.73,60.87 K1.NC
RELAY1_NO
  Bottom 1.27: 44.95,3.75 X5.1 45.64,3.73 59.04,17.13 59.04,53.84 55.74,57.14 50.92,57.14 47.19,60.87 K1.NO
RELAY2  (via drill 0.5)
  Top 0.305: U3.22 38.34,41.51 41.39,44.57 v44.57,44.57
  Bottom 0.305: Q8.1 R21.2 v44.57,44.57
RELAY2_COM
  Bottom 1.27: X10.2 34.93,5.97 38.47,9.51 46.34,9.51 55.49,18.66 55.49,34.91 46.48,43.92 K3.COM
RELAY2_NC
  Bottom 1.27: X10.3 39.93,5.89 41.77,7.74 47.11,7.74 57.27,17.89 57.27,36.77 K3.NC
RELAY2_NO
  Bottom 1.27: X10.1 29.93,6.68 34.66,11.42 45.71,11.42 53.71,19.42 53.71,33.14 45.41,41.44 K3.NO
RS232_RX
  Top 0.305: IC8.14 21.58,74.03 22.97,75.43 28.18,75.43 30.68,77.92 X1.2
RS232_TX
  Top 0.305: IC8.15 20.31,74.03 22.34,76.06 25.52,76.06 27.18,77.72 X9.1
RX
  Top 0.305: U3.10 34.79,56.75 33.9,57.65 33.9,60.06 33.39,60.57 31.61,60.57 30.72,61.46 30.72,63.36 22.85,71.23 IC8.13
SCL
  Bottom 0.305: U3.5 30.72,59.96 30.72,54.85 29.83,53.96 12.69,53.96 11.16,52.44 11.16,49.9 9.77,48.5 6.08,48.5 3.54,51.04 U4.3
SDA
  Bottom 0.305: U3.3 30.09,61.86 30.09,55.23 29.45,54.6 12.31,54.6 10.53,52.82 10.53,50.15 9.51,49.14 6.34,49.14 5.58,49.9 5.58,52.95 4.94,53.58 U4.4
SPI_CE0
  Top 0.305: U3.24 33.87,37.71 31.48,37.71 29.58,39.61 29.58,44.57 27.17,46.98 24.12,46.98 19.04,52.06 IC3.16
SPI_MISO
  Top 0.305: U3.21 31.49,41.51 30.34,42.66 30.34,45.07 27.67,47.74 24.63,47.74 20.31,52.06 IC3.15
SPI_MOSI
  Top 0.305: U3.19 31.61,44.05 31.1,44.57 31.1,45.45 28.05,48.5 25.13,48.5 21.58,52.06 IC3.14
SPI_SCK
  Top 0.305: IC3.13 22.85,52.06 25.52,49.39 28.56,49.39 30.09,47.87 33.39,47.87 33.9,47.36 33.9,40.27 U3.23
TX
  Top 0.305: U3.8 35.14,59.71 33.9,60.95 33.9,62.47 33.26,63.11 31.99,63.11 24.12,70.98 IC8.12
V+  (via drill 0.5)
  Top 0.305: R26.1 R22.2 R23.2 4.24,31.04 v4.31,30.98
  Top 0.813: X2.2 24.93,5.88 30.09,11.04 D3.C D4.A
  Bottom 0.305: v4.31,30.98 4.31,29.07 16.75,16.62 16.75,2.53 18.53,0.75 23.61,0.75 24.93,2.07 X2.2
VIN  (via drill 0.5)
  Top 0.508: K2.4 56.65,41.28 v49.77,34.41
  Top 0.813: D4.C 40.12,11.17 v40.12,13.7 v40.12,14.72 | v49.77,34.41 49.77,33.06 U1.1 46.32,32.98 C4.+
  Bottom 0.813: v40.12,13.7 40.12,17.89 43.3,21.07 49.65,21.07 51.55,22.97 51.55,32.63 v49.77,34.41

### Text on the board
tPlace: R | R / OUT2 | R / OUT1
bPlace: 5V | A3 | TANK_CONTROL_v1.0